# Altium schematic sheet PCA10_NBU1012_Cable.SchDoc
size A
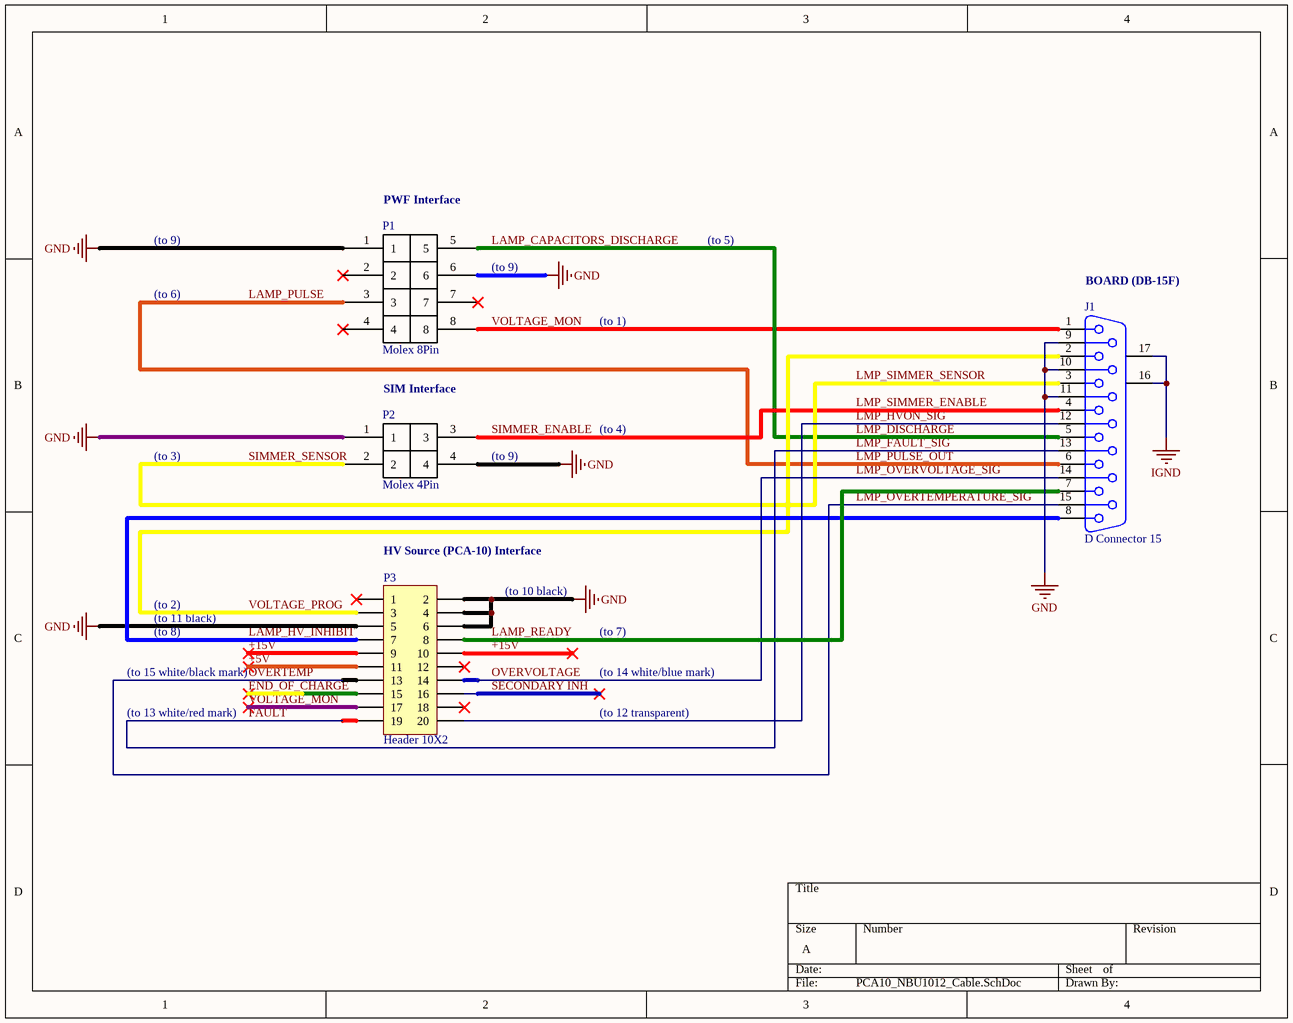
[diagram p0: PCA10_NBU1012_Cable.SchDoc]

## Parts
J1  D Connector 15  [DSUB1.385-2H15]
P1  Molex 8Pin
P2  Molex 4Pin
P3  Header 10X2  [HDR2X10]

## Nets
GND: J1.9 J1.10 J1.11 P1.1 P1.6 P2.1 P2.4 P3.2 P3.4 P3.5 P3.6
IGND: J1.16(MH1) J1.17(MH2)
+5V: P3.11
+15V: P3.9 P3.10
END_OF_CHARGE: P3.15
FAULT: J1.13 P3.19  [also labelled LMP_FAULT_SIG]
LAMP_CAPACITORS_DISCHARGE: J1.5 P1.5  [also labelled LMP_DISCHARGE]
LAMP_HV_INHIBIT: J1.8 P3.7
LAMP_PULSE: J1.6 P1.3  [also labelled LMP_PULSE_OUT]
LAMP_READY: J1.7 P3.8
LMP_HVON_SIG: J1.12 P3.20
LMP_OVERTEMPERATURE_SIG: J1.15 P3.13  [also labelled OVERTEMP]
LMP_OVERVOLTAGE_SIG: J1.14 P3.14  [also labelled OVERVOLTAGE]
LMP_SIMMER_ENABLE: J1.4 P2.3  [also labelled SIMMER_ENABLE]
LMP_SIMMER_SENSOR: J1.3 P2.2  [also labelled SIMMER_SENSOR]
SECONDARY INH: P3.16
VOLTAGE_MON: J1.1 P1.8 P3.17
VOLTAGE_PROG: J1.2 P3.3

Not connected (* = marked no-connect by the designer): P1 2* 4* 7*; P3 1* 12* 18*

## Notes on the sheet
- (near P1) PWF Interface
- (to 9)
- (to 6)
- (to 5)
- (near J1) BOARD (DB-15F)
- (to 1)
- SIM Interface
- (to 4)
- (to 3)
- (near P3) HV Source (PCA-10) Interface
- (to 11 black)
- (to 2)
- (to 8)
- (to 10 black)
- (to 7)
- (to 15 white/black mark)
- (to 14 white/blue mark)
- (to 13 white/red mark)
- (to 12 transparent)

## Library data of the parts
J1 = D Connector 15: Receptacle Assembly, 15 Position, Right Angle; PackageDocument: O; Positions: 15; Published: 15-Jun-2001; LatestRevisionDate: 17-Jul-2002; LatestRevisionNote: Re-released for DXP Platform.; DatasheetDocument: 1-Sep-99; PackageReference: 788757; Publisher: Altium Limited; Orientation: Right Angle; Gender: Receptacle
P3 = Header 10X2: Header, 10-Pin, Dual row; LatestRevisionDate: 17-Jul-2002; LatestRevisionNote: Re-released for DXP Platform.; Publisher: Altium Limited